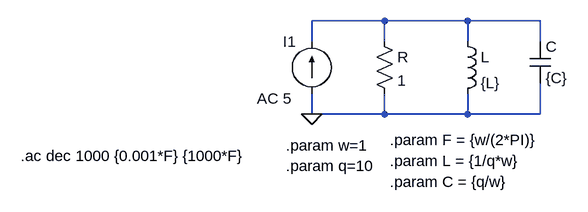
[diagram p0: schematic Circuito FINAL RLC en paralelo - FUENTE DE CORRIENTE.asc]
Circuito FINAL RLC en paralelo - FUENTE DE CORRIENTE.asc, the LTspice schematic file:
Version 4
SHEET 1 880 680
WIRE 112 96 0 96
WIRE 240 96 112 96
WIRE 352 96 240 96
WIRE 0 128 0 96
WIRE 112 128 112 96
WIRE 240 128 240 96
WIRE 352 128 352 96
WIRE 0 240 0 208
WIRE 112 240 112 208
WIRE 112 240 0 240
WIRE 240 240 240 208
WIRE 240 240 112 240
WIRE 352 240 352 192
WIRE 352 240 240 240
FLAG 0 240 0
SYMBOL res 96 112 R0
SYMATTR InstName R
SYMATTR Value 1
SYMBOL ind 224 112 R0
SYMATTR InstName L
SYMATTR Value {L}
SYMBOL cap 336 128 R0
SYMATTR InstName C
SYMATTR Value {C}
SYMBOL current 0 208 R180
WINDOW 3 24 0 Left 2
WINDOW 0 24 80 Left 2
WINDOW 123 31 -8 Left 2
WINDOW 39 0 0 Left 0
SYMATTR Value ""
SYMATTR InstName I1
SYMATTR Value2 AC 5
TEXT -40 288 Left 2 !.param w=1
TEXT 120 280 Left 2 !.param F = {w/(2*PI)}
TEXT -40 320 Left 2 !.param q=10
TEXT 120 312 Left 2 !.param L = {1/q*w}
TEXT 120 344 Left 2 !.param C = {q/w}
TEXT -448 304 Left 2 !.ac dec 1000 {0.001*F} {1000*F}

The netlist it stands for:
* Circuito FINAL RLC en paralelo - FUENTE DE CORRIENTE.asc
R N001 0 1
L N001 0 {L}
C N001 0 {C}
I1 0 N001 AC 5
.param w=1
.param F = {w/(2*PI)}
.param q=10
.param L = {1/q*w}
.param C = {q/w}
.ac dec 1000 {0.001*F} {1000*F}
.backanno
.end